# Altium schematic sheet DRV8353FH_v0.7_Schematic.SchDoc
size C; SheetNumber: 1; SheetTotal: 1
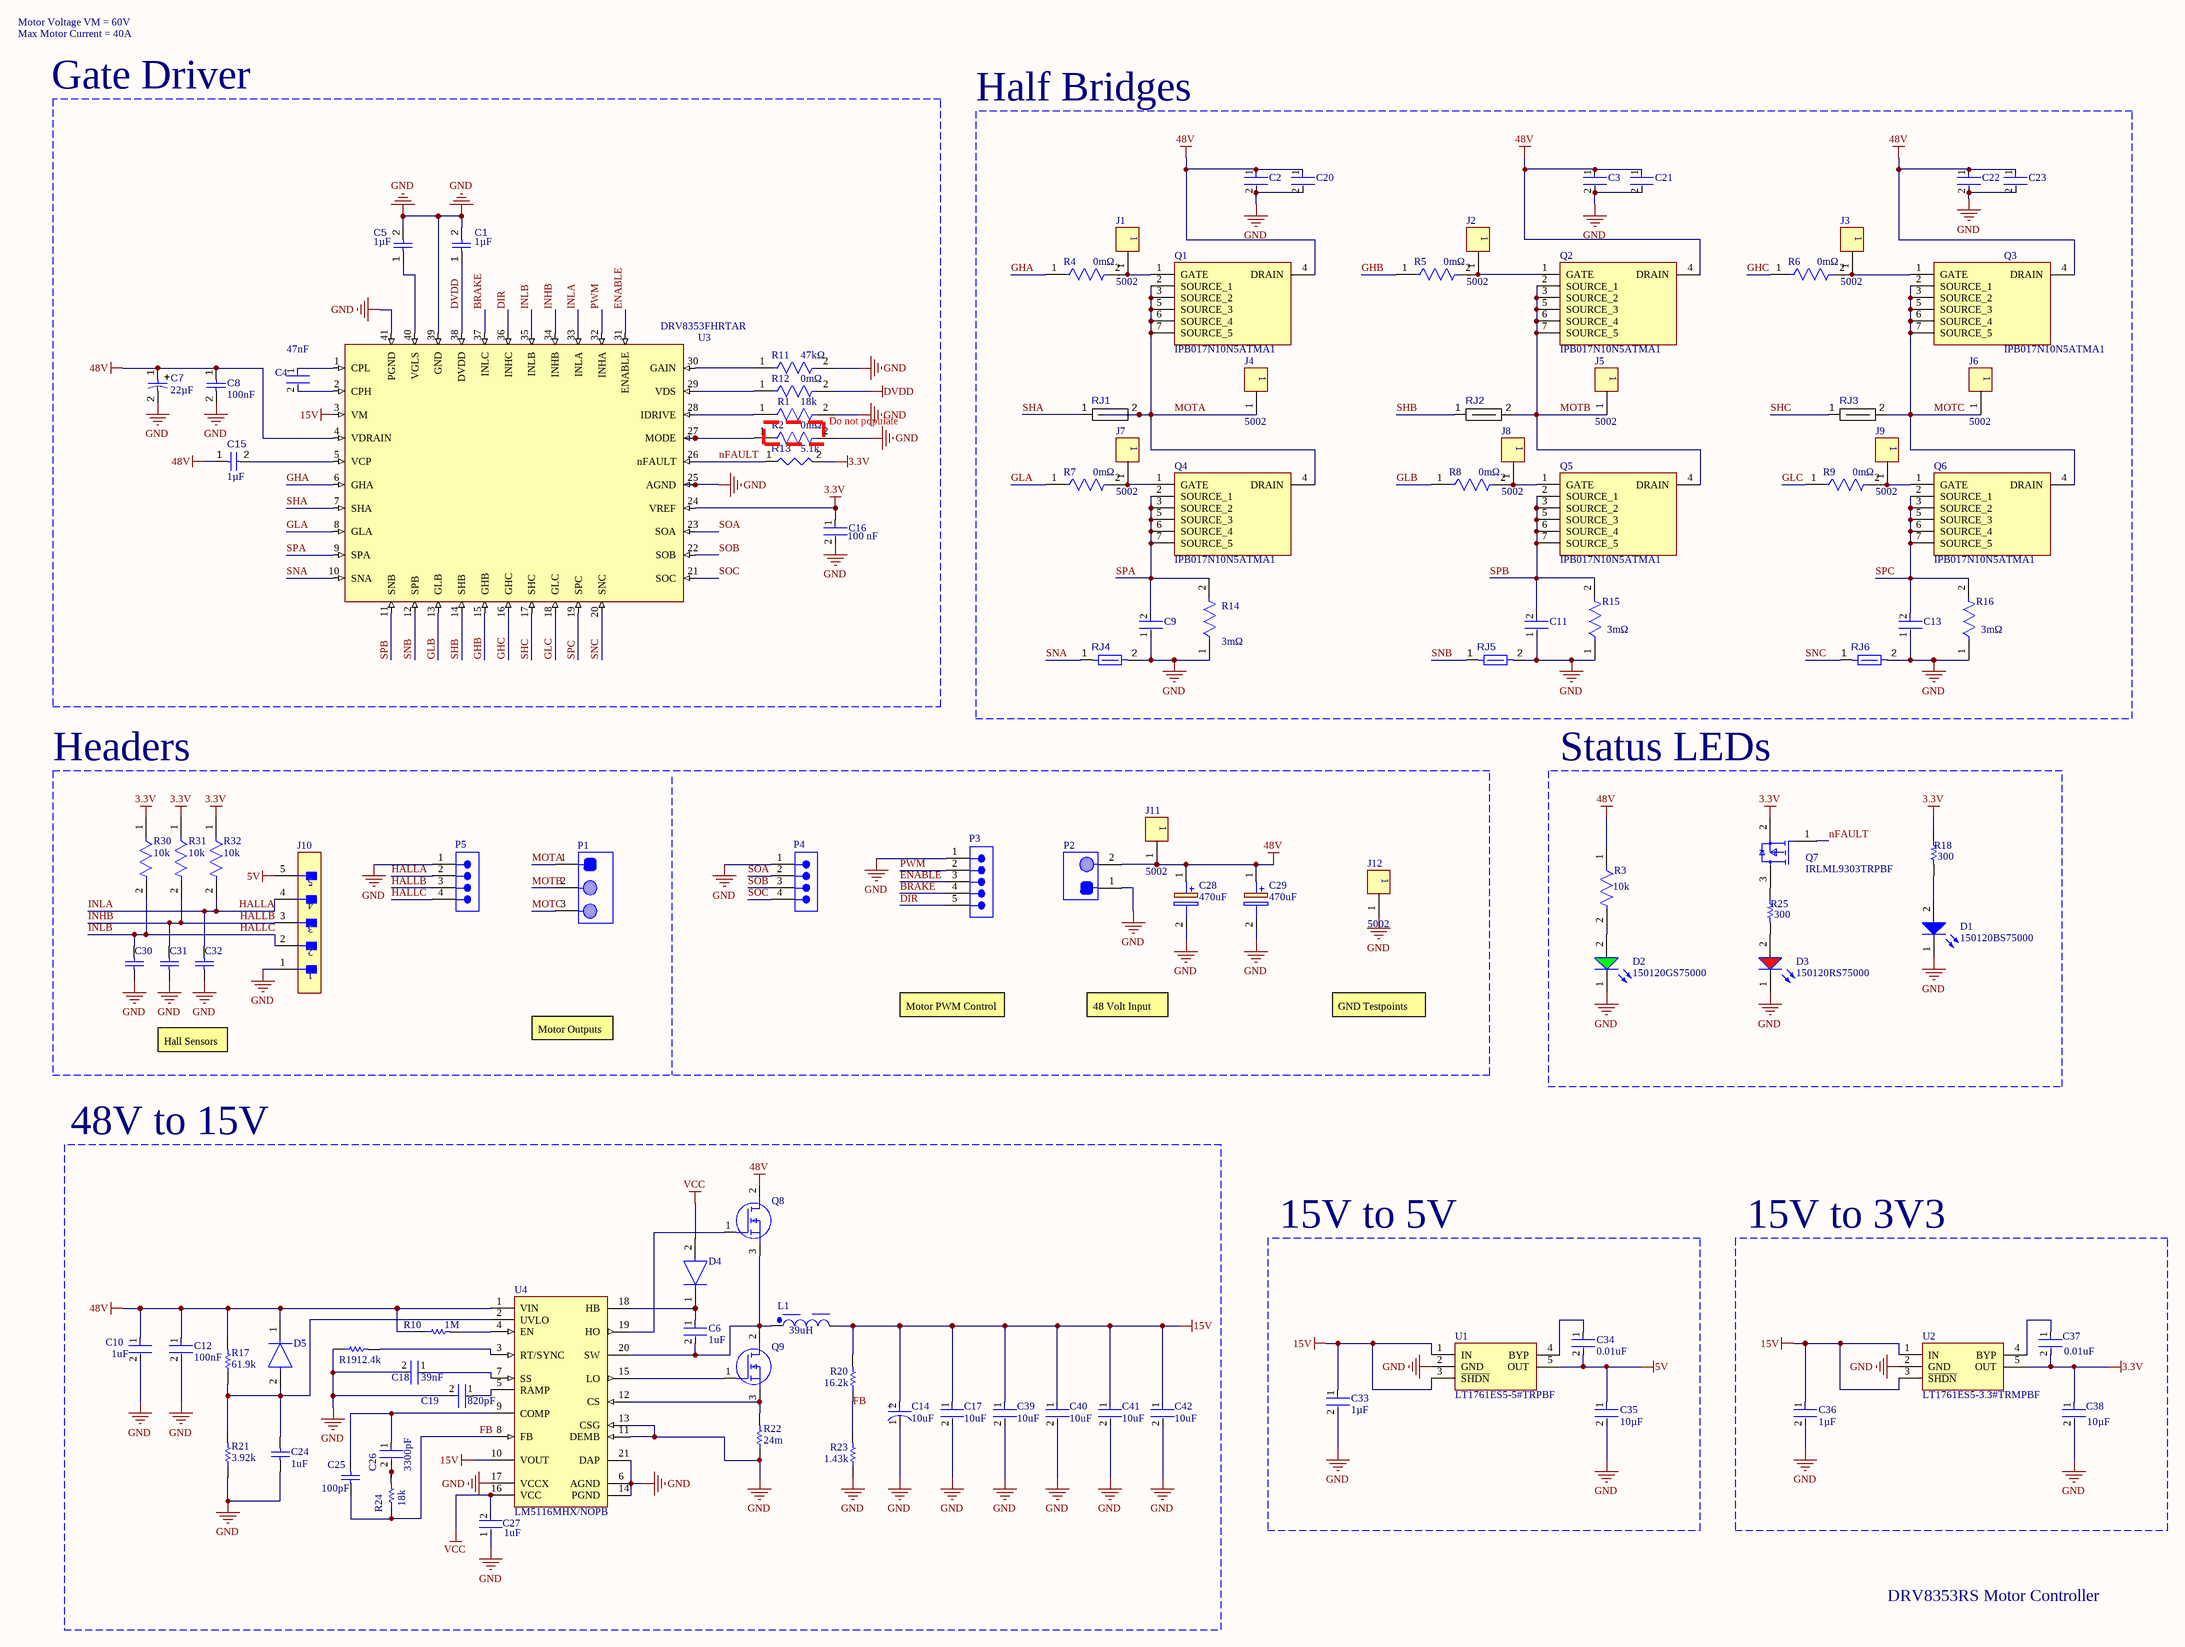
[diagram p0: DRV8353FH_v0.7_Schematic.SchDoc]

## Parts
C1  value 1µF  [FP-CC0603-DA-IPC_B]  (hidden comment: CC0603KRX5R8BB105)
C2  C1210C105K1RACTU  [FP-C1210C105K1RACTU-MFG]  (value not drawn)
C3  C1210C105K1RACTU  [FP-C1210C105K1RACTU-MFG]  (value not drawn)
C4  Capacitance: 47nF  [FP-GCJ21B-0_3-MFG]  (hidden comment: GCJ21BR72A473KA01L)
C5  value 1µF  [FP-CC0603-DA-IPC_B]  (hidden comment: CC0603KRX5R8BB105)
C6  1uF  [FP-CC0603-DA-MFG]
C7  value 22µF  [CAPAE8983X105N]  (hidden comment: UCD2A220MNL1GS)
C8  value 100nF  [FP-CL10-IPC_B]  (hidden comment: CL10B104KC8NNNC)
C9  C1608C0G2A102J080AA  [FP-C1608-080-0_1-MFG]  (value not drawn)
C10  1uF  [FP-CL32-IPC_C]
C11  C1608C0G2A102J080AA  [FP-C1608-080-0_1-MFG]  (value not drawn)
C12  100nF  [FP-GRM188-0_1-e0_2_0_5-IPC_B]
C13  C1608C0G2A102J080AA  [FP-C1608-080-0_1-MFG]  (value not drawn)
C14  10uF  [FP-OS-CON-SMT-C6-MFG]
C15  value 1µF  [FP-CC0603-DA-IPC_B]  (hidden comment: CC0603KRX5R8BB105)
C16  value 100 nF  [FP-CC0603-DA-MFG]  (hidden comment: CC0603KRX7R7BB104)
C17  10uF  [FP-CL31-IPC_C]
C18  39nF  [FP-C0805C-DN-MFG]
C19  820pF  [FP-C1608-080-0_1-IPC_C]
C20  C1210C105K1RACTU  [FP-C1210C105K1RACTU-MFG]  (value not drawn)
C21  C1210C105K1RACTU  [FP-C1210C105K1RACTU-MFG]  (value not drawn)
C22  C1210C105K1RACTU  [FP-C1210C105K1RACTU-MFG]  (value not drawn)
C23  C1210C105K1RACTU  [FP-C1210C105K1RACTU-MFG]  (value not drawn)
C24  1uF  [CAPC2013X140X50ML20T25]
C25  100pF  [CAPC1608X90X40ML10T20]
C26  3300pF  [FP-C0603C-CF-MFG]
C27  1uF  [FP-C1608-080-0_1-MFG]
C28  470uF  [CAPPRD750W85D1800H4200]
C29  470uF  [CAPPRD750W85D1800H4200]
C30  VJ0603Y102KXACW1BC  [CAPC1608X95X40NL15T15]  (value not drawn)
C31  VJ0603Y102KXACW1BC  [CAPC1608X95X40NL15T15]  (value not drawn)
C32  VJ0603Y102KXACW1BC  [CAPC1608X95X40NL15T15]  (value not drawn)
C33  1µF  [FP-CC0603-DA-MFG]
C34  0.01uF  [FP-CC0603-DA-MFG]
C35  10µF  [FP-CC0603-DC-IPC_A]
C36  1µF  [FP-CC0603-DA-MFG]
C37  0.01uF  [FP-CC0603-DA-MFG]
C38  10µF  [FP-CC0603-DC-IPC_A]
C39  10uF  [FP-CL31-IPC_C]
C40  10uF  [FP-CL31-IPC_C]
C41  10uF  [FP-CL31-IPC_C]
C42  10uF  [FP-CL31-IPC_C]
D1  150120BS75000  [WL-SMCW_1206_150120xx75000]
D2  150120GS75000  [WL-SMCW_1206_150120xx75000]
D3  150120RS75000  [WL-SMCW_1206_150120xx75000]
D4  (no value)  [FP-SOD523-MFG]
D5  (no value)  [FP-SOD523-MFG]
J1  5002  [FP-5002-MFG]
J2  5002  [FP-5002-MFG]
J3  5002  [FP-5002-MFG]
J4  5002  [FP-5002-MFG]
J5  5002  [FP-5002-MFG]
J6  5002  [FP-5002-MFG]
J7  5002  [FP-5002-MFG]
J8  5002  [FP-5002-MFG]
J9  5002  [FP-5002-MFG]
J10  22-29-2051  [FP-22-29-2051-MFG]  (value not drawn)
J11  5002  [FP-5002-MFG]
J12  5002  [FP-5002-MFG]
L1  39uH  [WE-PD_1210]
P1  VP0365540000G  [VP0365540000G-Footprint-1]  (value not drawn)
P2  VP0265540000G  [VP0265540000G-Footprint-1]  (value not drawn)
P3  (no value)  [61300511121]
P4  61300411121  [61300411121]  (value not drawn)
P5  61300411121  [61300411121]  (value not drawn)
Q1  IPB017N10N5ATMA1  [IPB017N10N5ATMA1]
Q2  IPB017N10N5ATMA1  [IPB017N10N5ATMA1]
Q3  IPB017N10N5ATMA1  [IPB017N10N5ATMA1]
Q4  IPB017N10N5ATMA1  [IPB017N10N5ATMA1]
Q5  IPB017N10N5ATMA1  [IPB017N10N5ATMA1]
Q6  IPB017N10N5ATMA1  [IPB017N10N5ATMA1]
Q7  IRLML9303TRPBF  [FP-Micro3-MFG]
Q8  (no value)  [RD3P175SNFRATL]
Q9  (no value)  [DMT10H009LK313]
R1  18k  [FP-CRCW0603-e3-IPC_A]
R2  Resistance: 0mΩ  [FP-RMCF0603-MFG]  (hidden comment: RMCF0603ZT0R00)
R3  Resistance: 10k  [FP-RK73H2B-IPC_C]  (hidden comment: RK73H2BTTDD1002F)
R4  Resistance: 0mΩ  [FP-RMCF0603-MFG]  (hidden comment: RMCF0603ZT0R00)
R5  Resistance: 0mΩ  [FP-RMCF0603-MFG]  (hidden comment: RMCF0603ZT0R00)
R6  Resistance: 0mΩ  [FP-RMCF0603-MFG]  (hidden comment: RMCF0603ZT0R00)
R7  Resistance: 0mΩ  [FP-RMCF0603-MFG]  (hidden comment: RMCF0603ZT0R00)
R8  Resistance: 0mΩ  [FP-RMCF0603-MFG]  (hidden comment: RMCF0603ZT0R00)
R9  Resistance: 0mΩ  [FP-RMCF0603-MFG]  (hidden comment: RMCF0603ZT0R00)
R10  1M  [RESC1608X55X25LL10T15]
R11  Resistance: 47kΩ  [FP-ERA3A-MFG]  (hidden comment: ERA-3AEB473V)
R12  Resistance: 0mΩ  [FP-RMCF0603-MFG]  (hidden comment: RMCF0603ZT0R00)
R13  value 5.1k  [FP-ERJ3EK-IPC_A]  (hidden comment: ERJ-3EKF5101V)
R14  value 3mΩ  [FP-PU2512-0R003-MFG]  (hidden comment: PU2512FKM130R003L)
R15  value 3mΩ  [FP-PU2512-0R003-MFG]  (hidden comment: PU2512FKM130R003L)
R16  value 3mΩ  [FP-PU2512-0R003-MFG]  (hidden comment: PU2512FKM130R003L)
R17  61.9k  [RESC1608X55X30ML15T15]
R18  300  [RESC1608X55X30LL20T20]
R19  12.4k  [RESC2013X60X40NL20T25]
R20  16.2k  [RESC1608X55X25NL10T15]
R21  3.92k  [RESC1608X55X30LL15T15]
R22  24m  [RESC3216X70X50NL05T20]
R23  1.43k  [RESC1608X55X30ML15T15]
R24  18k  [RESC1608X55X30LL15T15]
R25  300  [RESC1608X55X30LL20T20]
R30  10k  [FP-RC0603-0_55-IPC_C]
R31  10k  [FP-RC0603-0_55-IPC_C]
R32  10k  [FP-RC0603-0_55-IPC_C]
RJ1  Net Tie 30x70mil  [Net Tie 10x20mil-Footprint-1]  (value not drawn)  (net tie, no BOM)
RJ2  Net Tie 30x70mil  [Net Tie 10x20mil-Footprint-1]  (value not drawn)  (net tie, no BOM)
RJ3  Net Tie 30x70mil  [Net Tie 10x20mil-Footprint-1]  (value not drawn)  (net tie, no BOM)
RJ4  Net Tie 12x30mil  [SHORT06-FP]  (value not drawn)  (net tie, no BOM)
RJ5  Net Tie 12x30mil  [SHORT06-FP]  (value not drawn)  (net tie, no BOM)
RJ6  Net Tie 12x30mil  [SHORT06-FP]  (value not drawn)  (net tie, no BOM)
U1  LT1761ES5-5#TRPBF  [SOT95P280X90-5N]
U2  LT1761ES5-3.3#TRMPBF  [SOT95P280X100-5N]
U3  DRV8353FHRTAR  [QFN50P600X600X80_HS-41N]
U4  LM5116MHX/NOPB  [PWP0020A_M]

## Blocks framed on the sheet
Gate Driver: C1 C4 C5 C7 C8 C15 C16 R1 R2 R11-R13 U3
Half Bridges: C2 C3 C9 C11 C13 C20-C23 J1-J9 Q1-Q6 R4-R9 R14-R16 RJ1-RJ6
Headers: C28-C32 J10-J12 P1-P5 R30-R32
Status LEDs: D1-D3 Q7 R3 R18 R25
48V to 15V: C6 C10 C12 C14 C17-C19 C24-C27 C39-C42 D4 D5 L1 Q8 Q9 R10 R17 R19-R24 U4
15V to 5V: C33-C35 U1
15V to 3V3: C36-C38 U2

## Nets
3.3V: C16.1 C37.2 C38.1 Q7.2(S) R13.2 R18.1 R30.1 R31.1 R32.1 U2.5(OUT) U3.24(VREF)
5V: C34.2 C35.1 J10.5 U1.5(OUT)
15V: C14.2(A) C17.1 C33.1 C36.1 C39.1 C40.1 C41.1 C42.1 L1.2 R20.2 U1.1(IN) U1.3(~{SHDN}) U2.1(IN) U2.3(~{SHDN}) U3.3(VM) U4.10(VOUT)
48V: C2.1 C3.1 C7.1 C8.1 C10.1 C12.1 C15.1 C20.1 C21.1 C22.1 C23.1 C28.1(+) C29.1(+) D5.1(C) J11.1 P2.2 Q1.4(DRAIN) Q2.4(DRAIN) Q3.4(DRAIN) Q8.2(D) R3.1 R10.1 R17.2 U3.4(VDRAIN) U4.1(VIN)
DVDD: C1.1 R12.2 U3.38(DVDD)
GND: C1.2 C2.2 C3.2 C5.2 C7.2 C8.2 C9.1 C10.2 C11.1 C12.2 C13.1 C14.1(C) C16.2 C17.2 C18.2 C19.2 C20.2 C21.2 C22.2 C23.2 C24.1 C27.1 C28.2(-) C29.2(-) C30.1 C31.1 C32.1 C33.2 C35.2 C36.2 C38.2 C39.2 C40.2 C41.2 C42.2 D1.1(K) D2.1(K) D3.1(K) J10.1 J12.1 P2.1 P3.1 P4.1 P5.1 R1.2 R2.2 R11.2 R14.1 R15.1 R16.1 R19.1 R21.1 R22.1 R23.1 RJ4.2 RJ5.2 RJ6.2 U1.2(GND) U2.2(GND) U3.25(AGND) U3.39(GND) U3.41(PGND) U4.6(AGND) U4.11(DEMB) U4.13(CSG) U4.14(PGND) U4.17(VCCX) U4.21(DAP)
VCC: C27.2 D4.2(A) U4.16(VCC)
BRAKE: P3.4 U3.37(INLC)
DIR: P3.5 U3.36(INHC)
ENABLE: P3.3 U3.31(ENABLE)
FB: C25.1 R20.1 R23.2 R24.1 U4.8(FB)
GHA: R4.1 U3.6(GHA)
GHB: R5.1 U3.15(GHB)
GHC: R6.1 U3.16(GHC)
GLA: R7.1 U3.8(GLA)
GLB: R8.1 U3.13(GLB)
GLC: R9.1 U3.18(GLC)
HALLA: C32.2 J10.4 P5.2 R32.2 U3.33(INLA)  [also labelled INLA]
HALLB: C31.2 J10.3 P5.3 R31.2 U3.34(INHB)  [also labelled INHB]
HALLC: C30.2 J10.2 P5.4 R30.2 U3.35(INLB)  [also labelled INLB]
MOTA: J4.1 P1.1 Q1.2(SOURCE_1) Q1.3(SOURCE_2) Q1.5(SOURCE_3) Q1.6(SOURCE_4) Q1.7(SOURCE_5) Q4.4(DRAIN) RJ1.2
MOTB: J5.1 P1.2 Q2.2(SOURCE_1) Q2.3(SOURCE_2) Q2.5(SOURCE_3) Q2.6(SOURCE_4) Q2.7(SOURCE_5) Q5.4(DRAIN) RJ2.2
MOTC: J6.1 P1.3 Q3.2(SOURCE_1) Q3.3(SOURCE_2) Q3.5(SOURCE_3) Q3.6(SOURCE_4) Q3.7(SOURCE_5) Q6.4(DRAIN) RJ3.2
nFAULT: Q7.1(G) R13.1 U3.26(nFAULT)
PWM: P3.2 U3.32(INHA)
SHA: RJ1.1 U3.7(SHA)
SHB: RJ2.1 U3.14(SHB)
SHC: RJ3.1 U3.17(SHC)
SNA: RJ4.1 U3.10(SNA)
SNB: RJ5.1 U3.12(SPB)
SNC: RJ6.1 U3.20(SNC)
SOA: P4.2 U3.23(SOA)
SOB: P4.3 U3.22(SOB)
SOC: P4.4 U3.21(SOC)
SPA: C9.2 Q4.2(SOURCE_1) Q4.3(SOURCE_2) Q4.5(SOURCE_3) Q4.6(SOURCE_4) Q4.7(SOURCE_5) R14.2 U3.9(SPA)
SPB: C11.2 Q5.2(SOURCE_1) Q5.3(SOURCE_2) Q5.5(SOURCE_3) Q5.6(SOURCE_4) Q5.7(SOURCE_5) R15.2 U3.11(SNB)
SPC: C13.2 Q6.2(SOURCE_1) Q6.3(SOURCE_2) Q6.5(SOURCE_3) Q6.6(SOURCE_4) Q6.7(SOURCE_5) R16.2 U3.19(SPC)
NetC4_1: C4.1 U3.1(CPL)
NetC4_2: C4.2 U3.2(CPH)
NetC5_1: C5.1 U3.40(VGLS)
NetC6_1: C6.1 D4.1(C) U4.18(HB)
NetC6_2: C6.2 L1.1 Q8.3(S) Q9.2(D) U4.20(SW)
NetC15_2: C15.2 U3.5(VCP)
NetC18_1: C18.1 U4.7(SS)
NetC19_1: C19.1 U4.5(RAMP)
NetC24_2: C24.2 D5.2(A) R17.1 R21.2 U4.2(UVLO)
NetC25_2: C25.2 C26.1 U4.9(COMP)
NetC26_2: C26.2 R24.2
NetC34_1: C34.1 U1.4(BYP)
NetC37_1: C37.1 U2.4(BYP)
NetD1_2: D1.2(A) R18.2
NetD2_2: D2.2(A) R3.2
NetD3_2: D3.2(A) R25.2
NetJ1_1: J1.1 Q1.1(GATE) R4.2
NetJ2_1: J2.1 Q2.1(GATE) R5.2
NetJ3_1: J3.1 Q3.1(GATE) R6.2
NetJ7_1: J7.1 Q4.1(GATE) R7.2
NetJ8_1: J8.1 Q5.1(GATE) R8.2
NetJ9_1: J9.1 Q6.1(GATE) R9.2
NetQ7_3: Q7.3(D) R25.1
NetQ8_1: Q8.1(G) U4.19(HO)
NetQ9_1: Q9.1(G) U4.15(LO)
NetQ9_3: Q9.3(S) R22.2 U4.12(CS)
NetR1_1: R1.1 U3.28(IDRIVE)
NetR2_1: R2.1 U3.27(MODE)
NetR10_2: R10.2 U4.4(EN)
NetR11_1: R11.1 U3.30(GAIN)
NetR12_1: R12.1 U3.29(VDS)
NetR19_2: R19.2 U4.3(RT/SYNC)

## Notes on the sheet
- Motor Voltage VM = 60V
- Max Motor Current = 40A
- Do not populate
- Motor Outputs
- Motor PWM Control
- 48 Volt Input
- GND Testpoints
- Hall Sensors
- DRV8353RS Motor Controller
- (in symbol CMP-05428-000804-1) +

## Library data of the parts
C1 C5 C15 = CMP-001-00088-1: Ceramic Capacitor, Multilayer, Ceramic, 25V, 10% +Tol, 10% -Tol, X5R, 15% TC, 1uF, Surface Mount, 0603; Case/Package: 0603; Mounting Technology: Surface Mount; Pins: 2; Min Operating Temperature: -55°C; Max Operating Temperature: 85°C; RoHS Compliant: Yes; Capacitor Type: Ceramic
C2 C3 C20-C23 = CMP-03020-034669-1: CAP CER 1UF 100V X7R 1210; Dielectric Material: Ceramic; Tolerance: 10%; Capacitance: 1uF; Height: 1.7mm; Voltage Rating: 100V; Termination: SMD/SMT; Depth: 2.5mm; Construction: Flat; REACH SVHC: No SVHC; Length: 3.2mm; Case Code (Imperial): 1210; Radiation Hardening: No; Case/Package: 1210; Case Code (Metric): 3225; Mount: Surface Mount; Package Quantity: 1; Voltage Rating (DC): 100V; Min Operating Temperature: -55°C; Voltage: 100V; Thickness: 0.075inch; Width: 0.098inch; Max Operating Temperature: 125°C; Packaging: Tape and Reel; Series: C; RoHS Compliant: Yes; Number of Pins: 2; Dielectric: X7R
C4 = CMP-2007-03218-2: Multilayer Ceramic Capacitors MLCC - SMD/SMT 0805 47000pF 10%, 100VDC,  X7R 15%; Voltage Rating (DC): 100V; Package Quantity: 1; Case Code (Metric): 2012; Depth: 1.25mm; Termination: SMD/SMT; Mount: Surface Mount; Features: Soft Termination; Min Operating Temperature: -55°C; Lead Free: Lead Free; Ratings: AEC-Q200; Length: 2mm; Case Code (Imperial): 0805; Voltage Rating: 100V; Tolerance: 10%; Dielectric: X7R; Width: 0.049inch; Packaging: Tape and Reel; Thickness: 0.049inch; Case/Package: 0805; Max Operating Temperature: 125°C
C6 C33 C36 = CMP-03422-000612-1: CAP CER 1UF 25V X5R 0603; Manufacturer: YAGEO; Manufacturer Part Number: CC0603KRX5R8BB105; Material: Ceramic; Tolerance: 0.1; Temperature Coefficient: 15%; Automotive: No; Octopart: https://octopart.com/cc0603krx5r8bb105-yageo-9292811; Package: CC0603-DA; Temperature Range High: +125°C; Digikey Description: CAP CER 1UF 25V X5R 0603; Mouser Description: Multilayer Ceramic Capacitors MLCC - SMD/SMT 1.0uF 25V X5R 10%; Device Class L2: Capacitors; Category: Cap; Value: 1 uF; Temperature: -55°C to +125°C; ComponentLink2URL: http://www.yageo.com/documents/recent/UPY-GPHC_X7R_6.3V-to-50V_18.pdf; Capacitance: 1 uF; ComponentLink2Description: Datasheet; Voltage: 25 V; Height: 0.9mm; Device Class L3: Ceramic Capacitors; Temperature Characteristic: X5R; Footprint Url: http://www.yageo.com/exep/pages/download/literatures/UPY-C_GEN_24.pdf; Temperature Range Low: -55°C; Device Class L1: Passive Components; Voltage Rating: 25 V; Lead Free: Yes; RoHS: TRUE
C7 = CMP-001-00089-2: Aluminum Electrolytic Capacitor, Polarized, Aluminum (wet), 100V, 20% +Tol, 20% -Tol, 22uF, Surface Mount, 3333; Capacitor Type: Aluminium; Ripple Current: 65mA; RoHS Compliant: Yes; Mounting Technology: Surface Mount; Pins: 2; Case/Package: 3333; Max Operating Temperature: 105°C; Min Operating Temperature: -55°C
C8 = CMP-001-00090-1: Ceramic Capacitor, Multilayer, Ceramic, 100V, 10% +Tol, 10% -Tol, X7R, 15% TC, 0.1uF, Surface Mount, 0603; Case/Package: 0603; Min Operating Temperature: -55°C; Mounting Technology: Surface Mount; Capacitor Type: Ceramic; Max Operating Temperature: 125°C; Pins: 2; RoHS Compliant: Yes
C9 C11 C13 = CMP-08246-004841-1: Multilayer Ceramic Capacitors 1nF ±5% 100V C0G SMD 0603; Series: C; Case/Package: 0603; REACH SVHC: No SVHC; Max Operating Temperature: 125°C; Case Code (Metric): 1608; Case Code (Imperial): 0603; Width: 0.031inch; Weight: 7.1E-05oz; Termination: SMD/SMT; Length: 1.6mm; Voltage Rating: 100V; Height: 0.8mm; Tolerance: 5%; Capacitance: 1nF; RoHS Compliant: Yes; Mount: Surface Mount; Packaging: Tape and Reel; Package Quantity: 1; Voltage Rating (DC): 100V; Thickness: 0.037inch; Min Operating Temperature: -55°C; Dielectric: C0G; Lead Free: Lead Free; Depth: 0.8mm
C10 = CMP-13271-001930-1: Cap Ceramic 1uF 100V X7R ±10% SMD 1210 +125°C Embossed T/R; Radiation Hardening: No; Case Code (Metric): 3225; Height: 2.5mm; Voltage Rating: 100V; Thickness: 0.106inch; Tolerance: 10%; Length: 3.2mm; Case/Package: 1210; Voltage: 100V; Package Quantity: 1; Material: Ceramic; Mount: Surface Mount; Min Operating Temperature: -55°C; Capacitance: 1uF; Max Operating Temperature: 125°C; Case Code (Imperial): 1210; Dielectric: X7R; Width: 0.098inch; Lead Free: Lead Free; Depth: 2.5mm; Packaging: Tape and Reel
C12 = CMP-1035-02595-8: Chip Multilayer Ceramic Capacitors for General Purpose, 0603, 0.10uF, X7R, 15%, 10%, 100V; Voltage Rating (DC): 100V; Capacitance: 100nF; Material: Ceramic; Packaging: Tape and Reel; Dielectric: X7R; Case Code (Imperial): 0603; Package Quantity: 1; Height: 0.8mm; Weight: 0.000222oz; Min Operating Temperature: -55°C; Depth: 0.8mm; Mount: Surface Mount; Thickness: 0.035inch; Voltage: 100V; REACH SVHC: No SVHC; Case/Package: 0603; Voltage Rating: 100V; Width: 0.8mm; Tolerance: 10%; Lead Free: Lead Free; Case Code (Metric): 1608; Radiation Hardening: No; Max Operating Temperature: 125°C; Termination: SMD/SMT; Length: 1.6mm
C14 = CMP-05428-000804-1: Conductive Polymer Aluminum Solid Capacitors (OS-CON) 10uF ±20% 50V; ESR (Equivalent Series Resistance): 40mR; Ripple Current: 2.5A; Leakage Current: 100uA; Life (Hours): 5000Hour; Dissipation Factor: 12%; Voltage Rating (DC): 50V; Termination: SMD/SMT; Voltage Rating: 50V; Voltage: 50V; Min Operating Temperature: -55°C; Max Operating Temperature: 105°C; Height - Seated (Max): 0.236inch; Case/Package: Radial; Mount: Surface Mount; Height: 5.9mm; RoHS Compliant: Yes; Diameter: 6.3mm; Construction: Cylindrical; Ripple Current (AC): 2.5A; Series: OS-CON, SVPF; Length: 5.9mm; Package Quantity: 1000; REACH SVHC: No SVHC; Number of Pins: 6; Capacitance: 10uF; Packaging: Tape and Reel; Lead Free: Lead Free; Tolerance: 20%
C16 = CMP-2000-05002-2: CAP CER 0.1UF 16V X7R 0603; Manufacturer: YAGEO; Tolerance: 0.1; Temperature Coefficient: 15%; Material: Ceramic; Voltage Rating: 16 V; Package: CC0603-DA; ComponentLink2Description: Datasheet; Octopart: https://octopart.com/cc0603krx7r7bb104-yageo-192941; Temperature Range High: +125°C; Digikey Description: CAP CER 0.1UF 16V X7R 0603; Voltage: 16 V; Device Class L2: Capacitors; Height: 0.9mm; Temperature: -55°C to +125°C; Manufacturer Part Number: CC0603KRX7R7BB104; Device Class L1: Passive Components; Device Class L3: Ceramic Capacitors; ComponentLink2URL: http://www.yageo.com/documents/recent/UPY-GPHC_X7R_6.3V-to-50V_18.pdf; Footprint Url: http://www.yageo.com/exep/pages/download/literatures/UPY-C_GEN_24.pdf; RoHS: TRUE; Temperature Range Low: -55°C; Temperature Characteristic: X7R; Lead Free: Yes; Capacitance: 100 nF; Category: Cap; Mouser Description: Multilayer Ceramic Capacitor, CC Series, 0.1 - F, - 10%, X7R, 16 V, 0603 [1608 Metric]; Automotive: No
C17 C39-C42 = CMP-13271-000016-1: CAP CER 10UF 50V X5R 1206; Manufacturer: Samsung; Manufacturer Part Number: CL31A106KBHNNNE; Tolerance: 10%; Material: Ceramic; Temperature Coefficient: 15%; RoHS: TRUE; Ipc Land Pattern Name: CAPC320160X160; Temperature Range Low: -55°C; Value: 10uF; Device Class L3: Ceramic Capacitors; Category: Cap; Temperature Characteristic: X5R; Lead Free: Yes; Device Class L2: Capacitors; Octopart: https://octopart.com/cl31a106kbhnnne-samsung-19832778; ComponentLink2Description: Datasheet; Digikey Description: CAP CER 10UF 50V X5R 1206; Voltage: 50V; ComponentLink2URL: http://www.samsungsem.com/kr/support/product-search/mlcc/__icsFiles/afieldfile/2018/06/21/CL31A106KBHNNNE.pdf; Capacitance: 10uF; Temperature Range High: +85°C; Device Class L1: Passive Components; Height: 1.8mm; Automotive: No; Voltage Rating: 50V; Package: CL31; Temperature: -55°C to +85°C
C18 = CMP-03020-028283-1: C0805 39,000 pF U2J 30ppm/°C 1.00% 50 V; Manufacturer Part Number: C0805C393F5JACAUTO; Manufacturer: KEMET; Tolerance: 0.01; Material: Ceramic; Voltage Rating: 50 V; Lead Free: Yes; ComponentLink2URL: https://content.kemet.com/datasheets/KEM_C1003_C0G_SMD.pdf; Automotive: No; Package: C0805C-DN; RoHS: TRUE; Temperature Coefficient: 30ppm/°C; Temperature Range High: +125°C; Device Class L2: Capacitors; Value: 39,000 pF; ComponentLink2Description: Datasheet; Ipc Land Pattern Name: CAPC200125X78; Octopart: https://octopart.com/c0805c393f5jacauto-kemet-84731922; Temperature Characteristic: U2J; Category: Cap; Capacitance: 39,000 pF; Temperature: -55°C to +125°C; Temperature Range Low: -55°C; Device Class L1: Passive Components; Device Class L3: Ceramic Capacitors; Height: 0.88mm
C19 = CMP-08246-006248-1: Multilayer Ceramic Capacitors 820pF ±5% 50V C0G SMD 0603; Capacitance: 820pF; Width: 0.031inch; REACH SVHC: No SVHC; Mount: Surface Mount; Case Code (Metric): 1608; Number of Pins: 2; Construction: Flat; Case Code (Imperial): 0603; Dielectric: C0G; Packaging: Tape and Reel; Voltage Rating (DC): 50V; Thickness: 0.037inch; Termination: SMD/SMT; Voltage Rating: 50V; Series: C; Depth: 0.8mm; Lead Free: Lead Free; Min Operating Temperature: -55°C; RoHS Compliant: Yes; Case/Package: 0603; Tolerance: 5%; Package Quantity: 1; Radiation Hardening: No; Length: 1.6mm; Weight: 7.1E-05oz; Max Operating Temperature: 125°C; Height: 0.8mm; Dielectric Material: Ceramic
C24 = CMP-2007-03236-1: Manufacturer: Kemet; Part Number: C0805C105K5RACTU
C25 = CMP-2100-03594-1: Chip Capacitor, 100 pF, +/- 5%, 50 V, -55 to 125 degC, 0603 (1608 Metric), RoHS, Tape and Reel; Manufacturer: Yageo; Voltage Rating (DC): 50V; Dielectric: C0G; Temperature Coefficient: 30ppm/degC; Insulation Resistance: 100GR; Datasheet Version: Rev. 14, 07/2016; Manufacturer URL: http://www.yageo.com/; Packaging: TapeandReel; Mount: SurfaceMount; RoHSCompliant: True; Package Reference: 0603; Tolerance: 5%; Max Operating Temperature: 125degC; Case Code (Imperial): 0603; Capacitance: 100pF; Number of Pins: 2; Width: 0.8mm; Case Code (Metric): 1608; Voltage: 50V; REACH SVHC: Unknown; Package Description: 2-Pin Surface Mount Device, Body 1.6 x 0.8 mm; Composition: Ceramic; Lead Free: LeadFree; Min Operating Temperature: -55degC; Radiation Hardening: No; Depth: 0.8mm; Thickness: 0.035inch; Datasheet URL: http://www.yageo.com/documents/recent/UPY-GP_NP0_16V-to-50V_14.pdf; Termination: SMD/SMT; Package Quantity: 1; Length: 1.6mm; Voltage Rating: 50V; Height: 0.8mm; Case/Package: 0603
C26 = CMP-2006-03174-2: CAP CER 3300PF 50V 5% X7R 0603; Manufacturer Part Number: C0603C332J5RACTU; Manufacturer: KEMET; Automotive Grade: Grade 1; Material: Ceramic; Value: 3,300 pF; Temperature Coefficient: 30ppm/°C; Tolerance: 0.05; Temperature Range Low: -55°C; Device Class L3: Ceramic Capacitors; Temperature Characteristic: X7R; Temperature: -55°C to +125°C; Device Class L1: Passive Components; ComponentLink2URL: https://api.kemet.com/component-edge/download/datasheet/C0603C100J5GACAUTO.pdf; Automotive: Yes; Capacitance: 3,300 pF; RoHS: TRUE; Mouser Description: Multilayer Ceramic Capacitors MLCC - SMD/SMT 50volts 3300pF X7R 5%; Height: 0.87mm; Temperature Range High: +125°C; ComponentLink2Description: Datasheet; Voltage Rating: 50 V; Octopart: https://octopart.com/c0603c332j5ractu-kemet-9139905; Package: C0603C-CF; Lead Free: Yes; Device Class L2: Capacitors; Digikey Description: CAP CER 3300PF 50V 5% X7R 0603; Category: Cap
C27 = CMP-08246-004608-1: Multilayer Ceramic Capacitors 1μF ±10% 35V X7R SMD 0603; Voltage Rating (DC): 35V; Voltage Rating: 35V; Series: C; Weight: 7.1E-05oz; Depth: 0.8mm; Construction: Flat; Thickness: 0.035inch; Case Code (Metric): 1608; Mount: Surface Mount; Max Operating Temperature: 125°C; Tolerance: 10%; RoHS Compliant: Yes; Length: 1.6mm; Dielectric Material: Ceramic; Min Operating Temperature: -55°C; Termination: SMD/SMT; REACH SVHC: No SVHC; Width: 0.031inch; Height: 0.8mm; Package Quantity: 4000; Capacitance: 1uF; Case/Package: 0603; Case Code (Imperial): 0603; Dielectric: X7R; Packaging: Tape and Reel; Lead Free: Lead Free
C28 C29 = ECA-2CM471: Capacitor Polarised; Manufacturer_Name: Panasonic; Datasheet Link: http://industrial.panasonic.com/cdbs/www-data/pdf/RDF0000/ABA0000C1218.pdf; Height: 42mm; Manufacturer_Part_Number: ECA-2CM471; Mouser Part Number: 667-ECA-2CM471; Mouser Price/Stock: https://www.mouser.co.uk/ProductDetail/Panasonic/ECA-2CM471?qs=ZViRkZ2Nuny%252B8%2F6pNV8MGQ%3D%3D; Arrow Part Number: ECA-2CM471; Arrow Price/Stock: https://www.arrow.com/en/products/eca-2cm471/panasonic?region=nac
C30-C32 = CMP-2006-02121-1: Manufacturer: Vitramon; Part Number: VJ0603Y102KXACW1BC
C34 C37 = CMP-03422-000327-1: CAP CER 10000PF 25V X7R 0603; Manufacturer: YAGEO; Manufacturer Part Number: CC0603KRX7R8BB103; Tolerance: 0.1; Value: 10 nF; Temperature Coefficient: 15%; Material: Ceramic; Lead Free: Yes; Temperature Range Low: -55°C; Mouser Description: Multilayer Ceramic Capacitors MLCC - SMD/SMT 10nF 25V X7R 10%; Device Class L1: Passive Components; RoHS: TRUE; Digikey Description: CAP CER 10000PF 25V X7R 0603; Capacitance: 10 nF; Temperature: -55°C to +125°C; Footprint Url: http://www.yageo.com/exep/pages/download/literatures/UPY-C_GEN_24.pdf; Category: Cap; ComponentLink2URL: http://www.yageo.com/documents/recent/UPY-GPHC_X7R_6.3V-to-50V_18.pdf; Octopart: https://octopart.com/cc0603krx7r8bb103-yageo-9288195; Temperature Characteristic: X7R; ComponentLink2Description: Datasheet; Voltage Rating: 25 V; Package: CC0603-DA; Automotive: No; Voltage: 25 V; Device Class L3: Ceramic Capacitors; Device Class L2: Capacitors; Temperature Range High: +125°C; Height: 0.9mm
C35 C38 = CMP-03422-001507-1: CAP CER 10UF 10V X5R 0603; Tolerance: 10%; Case/Package: 0603; Length: 0.063inch; Capacitance: 10uF; Dielectric: X5R; Mount: Surface Mount; Case Code (Metric): 1608; Depth: 0.8mm; Voltage Rating (DC): 10V; Voltage Rating: 10V; Lead Free: Lead Free; Resistor Type: Ceramic; Packaging: Tape and Reel; Max Operating Temperature: 85°C; Termination: SMD/SMT; Min Operating Temperature: -55°C; Weight: 7.1E-05oz; Thickness: 0.035inch; Case Code (Imperial): 0603; Package Quantity: 4000; Halogen Free: Halogen Free; RoHS Compliant: Yes; Width: 0.031inch
D1 = CMP-1426-00015-3: WL-SMCW SMT Mono-Color Chip LED Waterclear; Manufacturer Package Identifier: LED_1206; Dominant Wavelength: 470nm; Lens Style: Clear, Rectangular; Test Current: 20mA; Forward Voltage: 3.2V; Forward Current: 100mA; Peak Wavelength: 465nm; Max Reverse Voltage (DC): 5V; Viewing Angle: 140°; Color: Blue; Luminous Intensity: 145mcd; Max Operating Temperature: 85°C; Case Code (Imperial): 1206; Length: 3.2mm; Width: 1.6mm; Min Operating Temperature: -40°C; Height: 680µm; Case Code (Metric): 3216; Packaging: Tape and Reel; RoHS: Compliant; Case/Package: 1206; REACH SVHC: Unknown; Wavelength: 470nm; Mount: Surface Mount
D2 = CMP-1426-00014-4: WL-SMCW SMT Mono-Color Chip LED Waterclear; Dominant Wavelength: 525nm; Reverse Voltage: 5V; Max Junction Temperature (Tj): 95°C; Lens Style: Clear, Rectangular; Forward Voltage: 3.2V; Power Dissipation: 105mW; Peak Wavelength: 515nm; Test Current: 20mA; Color: Green; Forward Current: 100mA; Luminous Intensity: 450mcd; Viewing Angle: 140°; Case Code (Imperial): 1206; REACH SVHC: Unknown; Packaging: Tape and Reel; Max Operating Temperature: 85°C; Case/Package: 1206; Height: 680µm; Length: 3.2mm; Mount: Surface Mount; Min Operating Temperature: -40°C; Width: 1.6mm; Case Code (Metric): 3216; Max Reverse Voltage (DC): 5V; RoHS: Compliant; Wavelength: 525nm
D3 = CMP-1426-00013-4: WL-SMCW SMT Mono-Color Chip LED Waterclear; Luminous Intensity: 150mcd; Max Junction Temperature (Tj): 95°C; Lens Style: Clear, Rectangular; Color: Red; Wavelength: 625nm; Forward Current: 100mA; Test Current: 20mA; Power Dissipation: 72mW; Forward Voltage: 2V; Peak Wavelength: 630nm; Reverse Voltage: 5V; Viewing Angle: 140°; Length: 3.2mm; Case Code (Imperial): 1206; Mount: Surface Mount; Case/Package: 1206; Packaging: Tape and Reel; REACH SVHC: Unknown; Max Operating Temperature: 85°C; RoHS: Compliant; Height: 680µm; Dominant Wavelength: 625nm; Width: 1.6mm; Max Reverse Voltage (DC): 5V; Case Code (Metric): 3216; Min Operating Temperature: -40°C
D4 D5 = CMP-14399-000014-1: DIODE GEN PURP 100V 250MA SOD523; RoHS Compliant: Yes
J1-J9 J11 J12 = CMP-2000-05182-2: PC TEST POINT MINIATURE WHITE; Body Material: Bronze; Insulation: Insulated; Inside Diameter: 1.27mm; Number of Ports: 1; Outside Diameter: 2.54mm; Hole Diameter: 1.6mm; Plating: Silver; Contact Plating: Silver; Orientation: Straight; REACH SVHC: No SVHC; Series: THM; Packaging: Bulk; Material: Nylon; Flammability Rating: UL94 V-0; Mount: Through Hole; Color: White; Housing Color: White; Length: 7.62mm; Contact Material: Bronze; Lead Free: Lead Free; Package Quantity: 100; RoHS Compliant: Yes
J10 = CMP-04776-000816-1: 2.54MM KK HDR VT FRICLK VRA .5AU; Number of Circuits: 5; Connector Type: Male Pin; Max Current Rating: 7A; Glow Wire Compliant: Non-compliant; Insulation Resistance: 50GR; Gender: Male; Current Rating: 4A; Number of Lines: 1; Max Voltage Rating (AC): 250V; Contact Resistance: 10mR; Orientation: Straight; Height: 14.73mm; Contact Plating: Gold; Series: KK® 6410; Number of Poles: 5; Mount: Through Hole; Length: 12.7mm; Packaging: Bulk; Package Quantity: 10; Depth: 5.8mm; Housing Color: White; Pitch: 2.54mm; Number of Positions: 5; Contact Mating Length: 0.295inch; Max Operating Temperature: 75°C; Housing Material: Nylon; Termination: Solder; Contact Material: Brass; Flammability Rating: UL94 V-0; Number of Contacts: 5; Color: Natural; Min Operating Temperature: 0°C; Radiation Hardening: No; Contact Type: Male Pin; Number of Rows: 1; Voltage Rating: 250V; Voltage Rating (DC): 250V; Contact Gender: Male; Fastening Type: Friction; Lead Free: Lead Free; Halogen Free: Low Halogen
L1 = CMP-0227-00184-2: NexarPartId: 22866922; Inductance: 39µH; RMS Current (Irms): 4.1A; Saturation Current: 5A; Tolerance: 20%; Core Material: Ferrite; Series Resistance: 56mΩ; Self Resonant Frequency: 6MHz; DC Resistance (DCR): 44mΩ; Test Frequency: 1kHz; Shielding: Shielded; Max Operating Temperature: 125°C; RoHS: Compliant; Case/Package: Nonstandard; Height - Seated (Max): 10.0076mm; Number of Pins: 2; REACH SVHC: Unknown; Height: 10mm; Mount: Surface Mount; Ambient Temperature Range Low: -40°C; Case Code (Metric): 3225; Lead Pitch: 7mm; Current Rating: 4.1A; Min Operating Temperature: -40°C; Packaging: Cut Tape (CT); Width: 12mm; Composition: Wirewound; Max DC Current: 4.1A; Case Code (Imperial): 1210; Inductance Tolerance: 20%; Lead Free: Lead Free; Resistance: 56mΩ; Termination: SMD/SMT; Depth: 12mm; Ambient Temperature Range High: 85°C; Length: 12mm
P1 = CMP-002-00077-2: VP10.16-3P slot screws Cr3 zinc, solder foot bright tin, steel stamping clamp; RoHS Compliant: Yes
P2 = CMP-002-00073-1: VP10.16-2P slot screws Cr3+ zinc, solder foot bright tin, steel stamping clamp; RoHS Compliant: Yes
P3 = CMP-1502-01068-3: NexarPartId: 32855526; Connector Type: Male Pin; Gender: Male; Contact Resistance: 20mΩ; Pitch: 2.54mm; Operating Supply Voltage: 250V; Current Rating: 3A; Number of Contacts: 5; Lead Free: Lead Free; Color: Black; Packaging: Bulk; Lead Pitch: 2.54mm; Contact Material: Copper; Min Operating Temperature: -40°C; Contact Mating Length: 5.9944mm; Voltage Rating: 250V; Number of Pins: 5; Number of Positions: 5; Height: 8.89mm; Orientation: Vertical; REACH SVHC: Unknown; RoHS: Compliant; Contact Plating: Gold; Max Operating Temperature: 105°C; Mount: Through Hole; Number of Rows: 1; Termination: Solder
P4 P5 = CMP-1502-01064-3: NexarPartId: 32855522; Operating Supply Voltage: 250V; Pitch: 2.54mm; Contact Resistance: 20mΩ; Number of Positions: 4; Current Rating: 3A; Connector Type: Male Pin; Gender: Male; Contact Plating: Gold; Height: 8.89mm; Lead Pitch: 2.54mm; Lead Free: Lead Free; Contact Mating Length: 5.9944mm; Number of Rows: 1; Termination: Solder; Packaging: Bulk; REACH SVHC: Unknown; Min Operating Temperature: -40°C; RoHS: Compliant; Number of Contacts: 4; Voltage Rating: 250V; Color: Black; Max Operating Temperature: 105°C; Contact Material: Copper; Mount: Through Hole; Orientation: Vertical; Number of Pins: 4
Q1-Q6 = IPB017N10N5ATMA1: MOSFET (N-Channel); Manufacturer_Name: Infineon; Datasheet Link: https://www.infineon.com/dgdl/Infineon-IPB017N10N5-DataSheet-v02_05-EN.pdf?fileId=5546d4624a75e5f1014ac4a981111eed; Height: 4.82mm; Manufacturer_Part_Number: IPB017N10N5ATMA1; Mouser Part Number: 726-IPB017N10N5ATMA1; Mouser Price/Stock: https://www.mouser.co.uk/ProductDetail/Infineon-Technologies/IPB017N10N5ATMA1?qs=3Bi3m9r5MQZXrupZoiX5%252BA%3D%3D; Arrow Part Number: IPB017N10N5ATMA1; Arrow Price/Stock: https://www.arrow.com/en/products/ipb017n10n5atma1/infineon-technologies-ag?region=nac
Q7 = CMP-32901-000148-1: MOSFET P-CH 30V 2.3A SOT-23-3; Manufacturer: Infineon; Turn On Delay Time: 7.5ns; Continuous Drain Current: -2.3A; Reverse Recovery Time: 12ns; Power Dissipation: 1.25W; Rthja Max: 100°C/W; Number Of P Channels: 1; Gate To Source Voltage: 20V; Drain To Source Voltage: -30V; Drain To Source Resistance: 220mΩ; Input Capacitace At Vds: 160pF @ -25V; Max Junction Temp: +150°C; Gate Charge At Vgs: 2nC @ -4.5V; Max Forward Diode Voltage: -1.2V; Threshold Vgs Min: -1.3V; Turn Off Delay Time: 9ns; Standoff Height: 0.01mm; Depletion Mode: False; Threshold Vgs Max: -2.4V; Reverse Recovery Charge: 5.3nC; Pulse Drain Current: -12A; Category: Trans; Temperature Range Low: -55°C; Octopart: https://octopart.com/irlml9303trpbf-infineon-65874991; Temperature Range High: +150°C; Footprint Url: http://www.irf.com/package/outline/po_micro3.pdf; Height: 1.12mm; Drain To Source Breakdown Voltage: -30V; Package: Micro3; RoHS: TRUE; ComponentLink2Description: Datasheet; Device Class L3: MOSFETs; Automotive: No; Lead Free: Yes; Digikey Description: MOSFET P-CH 30V 2.3A SOT-23-3; Temperature: -55°C to +150°C; ComponentLink2URL: https://www.infineon.com/dgdl/irlml9303pbf.pdf?fileId=5546d462533600a401535668ef1d2642; Device Class L2: Transistors; Manufacturer Part Number: IRLML9303TRPBF; Number Of Channels: 1; Device Class L1: Discrete Semiconductors
Q8 = RD3P100SNTL1: MOSFET (N-Channel); Manufacturer_Name: ROHM Semiconductor; Datasheet Link: https://fscdn.rohm.com/en/products/databook/datasheet/discrete/transistor/mosfet/rd3p100sntl-e.pdf; Manufacturer_Part_Number: RD3P100SNTL1; Mouser Part Number: 755-RD3P100SNTL1; Mouser Price/Stock: https://www.mouser.co.uk/ProductDetail/ROHM-Semiconductor/RD3P100SNTL1?qs=YCa%2FAAYMW03xNjsfPzXb3Q%3D%3D
Q9 = DMT10H009LK3-13: MOSFET (N-Channel); Manufacturer_Name: Diodes Incorporated; Datasheet Link: https://www.diodes.com/assets/Datasheets/DMT10H009LK3.pdf; Height: 2.52mm; Manufacturer_Part_Number: DMT10H009LK3-13; Mouser Part Number: 621-DMT10H009LK3-13; Mouser Price/Stock: https://www.mouser.co.uk/ProductDetail/Diodes-Incorporated/DMT10H009LK3-13?qs=xZ%2FP%252Ba9zWqbi7mi9i9bxbg%3D%3D; Arrow Part Number: DMT10H009LK3-13; Arrow Price/Stock: https://www.arrow.com/en/products/dmt10h009lk3-13/diodes-incorporated?region=nac
R1 = CMP-2000-02958-2: RES Thick Film, 18kΩ, 1%, 0.1W, 100ppm/°C, 0603; Max Power Dissipation: 100mW; Working Voltage: 75V; Resistance: 18kR; Min Operating Temperature: -55°C; Package Quantity: 10; Height: 0.45mm; Width: 0.033inch; Depth: 0.85mm; Radiation Hardening: No; Lead Free: Lead Free; Number of Pins: 2; Composition: Thick Film; Case Code (Imperial): 0603; Temperature Coefficient: 100ppm/°C; Military Standard: Not; Features: Automotive AEC-Q200; Power Rating: 100mW; Number of Terminations: 2; Weight: 7.1E-05oz; Case/Package: 0603; Voltage Rating: 75V; Mount: Surface Mount; Termination: SMD/SMT; Voltage Rating (DC): 75V; Length: 1.55mm; Case Code (Metric): 1608; Tolerance: 1%; Packaging: Tape and Reel; Max Operating Temperature: 155°C; Contact Plating: Tin
R2 R4-R9 R12 = CMP-26527-000011-1: RES 0 OHM JUMPER 1/10W 0603; Manufacturer: Stackpole; Power Rating: 0.1W; Voltage Rating: 75V; Automotive Grade: Grade 0; Value: 0mΩ; Series: RMCF; Manufacturer Part Number: RMCF0603ZT0R00; Device Class L1: Passive Components; Device Class L3: Chip SMD Resistors; Octopart: https://octopart.com/rmcf0603zt0r00-stackpole+electronics-19213618; Temperature: -55°C to +155°C; Lead Free: Yes; ComponentLink2URL: https://www.seielect.com/catalog/sei-rmcf_rmcp.pdf; Height: 0.55mm; Composition: Thick Film; Package: RMCF0603; Automotive: Yes; Temperature Range High: +155°C; Ipc Land Pattern Name: RESC15580X45; Digikey Description: RES 0 OHM JUMPER 1/10W 0603; RoHS: TRUE; ComponentLink2Description: Datasheet; Temperature Range Low: -55°C; Category: Res; Device Class L2: Resistors
R3 = CMP-2003-01644-2: 10kΩ ±1% 0.25W Chip Resistor 1206 Thick Film AEC-Q200 Qualified; Voltage Rating: 200V; Temperature Coefficient: 100ppm/°C; Power Rating: 250mW; Max Operating Temperature: 155°C; Min Operating Temperature: -55°C; Case/Package: Molded; Case Code (Imperial): 1206; RoHS Compliant: Yes; Packaging: Tape and Reel; Series: RK73H; Lead Free: Lead Free; Voltage Rating (DC): 200V; Tolerance: 1%; Termination: SMD/SMT; Case Code (Metric): 3216
R10 = CMP-1659-00056-1: Chip Resistor, 1 MOhm, +/- 1%, 100 mW, -55 to 155 degC, 0603 (1608 Metric), RoHS, Tape and Reel; Voltage Rating (DC): 25 V; Tolerance: 20%; Case\Package: Radial; Capacitance: 1 mF; Min Operating Temperature: -40 degC; PackageDescription: 2-Pin Surface Mount Device, Body 1.6 x 0.8 mm; ComponentLink1Description: Manufacturer URL; Radiation Hardening: No; DatasheetVersion: Rev. 4, 02/2016; REACH SVHC: No SVHC; Length: 20 mm; Max Operating Temperature: 85 degC; Diameter: 10 mm; Packaging: Bulk; Package Quantity: 200; PackageReference: 0603; Mount: Through Hole; ComponentLink1URL: http://www.yageo.com/; ComponentLink2URL: http://www.yageo.com/documents/recent/PYu-RC_Group_51_RoHS_L_04.pdf; ComponentLink2Description: Datasheet; Width: 0 inch; Lead Pitch: 5 mm; RoHSCompliant: true; Voltage Rating: 25 V; Height: 20 mm
R11 = CMP-2000-00073-6: NexarPartId: 1168820; Temperature Coefficient: 25ppm/°C; Voltage Rating: 75V; Max Power Dissipation: 100mW; Tolerance: 0.1%; Height: 450µm; Depth: 800µm; Min Operating Temperature: -55°C; Schedule B: 8533210045, 8533210045; RoHS: Compliant; Number of Pins: 2; Termination: SMD/SMT; Length: 1.6mm; Max Operating Temperature: 155°C; Contact Plating: Tin; Mount: Surface Mount; Radiation Hardening: No; Lead Free: Lead Free; Case Code (Metric): 1608; Features: Automotive AEC-Q200; Number of Terminations: 2; Composition: Thin Film; REACH SVHC: No SVHC; Military Standard: Not; Case Code (Imperial): 0603; Width: 800µm; Lifecycle Status: Production; Packaging: Cut Tape; Case/Package: 0603; Power Rating: 100mW; Voltage Rating (DC): 75V
R13 = CMP-009-00178-1: Fixed Resistor, Metal Glaze/thick Film, 0.1W, 5100ohm, 75V, 1% +/-Tol, 100ppm/Cel, Surface Mount, 0603; Power: 100mW; Case/Package: 0603; Tolerance: 1%; Min Operating Temperature: -55°C; Max Operating Temperature: 155°C; RoHS Compliant: Yes; Mounting Technology: Surface Mount; Pins: 2
R14-R16 = CMP-03412-016878-1: METAL SHUNT RESISTOR 2512 1% 75P; Manufacturer: Yageo; Automotive Grade: Grade 0; Temperature Coefficient: 75ppm/°C; Power Rating: 4W; Device Class L2: Resistors; RoHS: TRUE; Tolerance: 1%; Category: Res; Composition: Metal Element; Digikey Description: METAL SHUNT RESISTOR 2512 1% 75P; Octopart: https://octopart.com/pu2512fkm130r003l-yageo-96774567; Temperature Range Low: -65°C; Temperature Range High: +170°C; Temperature: -65°C to +170°C; Lead Free: Yes; Package: PU2512-0R003; Height: 1.07mm; Device Class L3: Chip SMD Resistors; Series: PU; Ipc Land Pattern Name: RESC635318X79; Automotive: Yes; ComponentLink2Description: Datasheet; Resistance: 3mΩ; Manufacturer Part Number: PU2512FKM130R003L; ComponentLink2URL: http://www.yageo.com/documents/recent/PYu-PU_51_RoHS_L_6.pdf; Device Class L1: Passive Components
R17 = CMP-2000-00591-1: Manufacturer: Panasonic; Part Number: ERJ-3EKF6192V
R18 R25 = CMP-2000-00025-1: Part Number: ERA3AEB301V; Manufacturer: Panasonic
R19 = CMP-2001-00733-1: Manufacturer: Panasonic; Part Number: ERA6AEB1242V
R20 = CMP-1012-00645-2: Part Number: RC0603FR-0716K2L; Manufacturer: Yageo
R21 = CMP-2000-00479-1: Part Number: ERJ-3EKF3921V; Manufacturer: Panasonic
R22 = CMP-2003-00795-1: Part Number: ERJ8CWFR024V; Manufacturer: Panasonic
R23 = CMP-2000-00250-1: Manufacturer: Panasonic; Part Number: ERJ-3EKF1431V
R24 = CMP-1012-00650-3: Fixed Resistor, Metal Glaze/thick Film, 0.1W, 18000ohm, 75V, 1% +/-Tol, 100ppm/Cel, Surface Mount, 0603; Manufacturer: Panasonic; Part Number: ERJ3EKF1802V
R30-R32 = CMP-2100-03664-2: RES 10K OHM 1% 1/10W 0603; Voltage Rating: 75V; Voltage Rating (DC): 50V; Resistance: 10kR; Power Rating: 100mW; Temperature Coefficient: 100ppm/°C; Depth: 0.8mm; Termination: SMD/SMT; Resistor Type: Thick Film; Series: RC; Construction: Rectangular; Features: Moisture Resistant; Packaging: Tape and Reel; Min Operating Temperature: -55°C; Number of Terminations: 2; Lead Pitch: 0.3mm; RoHS Compliant: Yes; Case/Package: 0603; Resistance Tolerance: 1%; Military Standard: Not; Weight: 7.1E-05oz; Number of Pins: 2; Tolerance: 1%; Length: 1.6mm; Case Code (Imperial): 0603; Lead Free: Lead Free; Width: 0.8mm; Max Power Dissipation: 100mW; Height: 0.45mm; Max Operating Temperature: 155°C; Case Code (Metric): 1608; Size Code: 0603
RJ1-RJ3 = CMP-009-00182-11
RJ4-RJ6 = CMP-009-00121-4: Min Operating Temperature: -55°C; Pins: 2; Max Operating Temperature: 155°C
U1 = LT1761ES5-5#TRPBF: Integrated Circuit; Manufacturer_Name: Analog Devices; Datasheet Link: http://www.linear.com/docs/2732; Height: 0.9mm; Manufacturer_Part_Number: LT1761ES5-5#TRPBF; Mouser Part Number: 584-LT1761ES5-5TRPBF; Mouser Price/Stock: https://www.mouser.co.uk/ProductDetail/Analog-Devices/LT1761ES5-5TRPBF?qs=ytflclh7QUUQ7rqS%2F83XIQ%3D%3D; Arrow Part Number: LT1761ES5-5#TRPBF; Arrow Price/Stock: https://www.arrow.com/en/products/lt1761es5-5trpbf/analog-devices?utm_currency=USD&region=europe
U2 = LT1761ES5-3.3#TRMPBF: Integrated Circuit; Manufacturer_Name: Analog Devices; Datasheet Link: http://www.analog.com/media/en/technical-documentation/data-sheets/1761sff.pdf; Height: 1mm; Manufacturer_Part_Number: LT1761ES5-3.3#TRMPBF; Mouser Part Number: 584-1761ES5-3.3TMPF; Mouser Price/Stock: https://www.mouser.co.uk/ProductDetail/Analog-Devices/LT1761ES5-3.3TRMPBF?qs=ytflclh7QUX%2Fum%2FNCPKPyw%3D%3D; Arrow Part Number: LT1761ES5-3.3#TRMPBF; Arrow Price/Stock: https://www.arrow.com/en/products/lt1761es5-3.3trmpbf/analog-devices?utm_currency=USD&region=europe
U3 = CMP-00024-00007-3: Brushless DC Motor Controller, PQCC40
U4 = CMP-0069-01482-3: Wide Range Synchronous Buck Controller, 20-pin TSSOP-EP, Pb-Free; Manufacturer: Texas Instruments; PackageTopMarking: NSUZXYTT*LM5116*MH; PowerWise: Y; CompType: Switcher; ComponentLink1URL: http://www.ti.com/general/docs/lit/getliterature.tsp?genericPartNumber=LM5116&fileType=pdf; PackageReference: PWP0020A; RoHS: Y; PinCount: 20; Code_JEDEC: MO-153-ACT; PackageDescription: Molded TSSOP, Jedec, 6.5 x 4.4 x 0.9mm Body, 20 Lead, 0.65mm Pitch, Exposed Pad; ComponentLink1Description: Datasheet URL